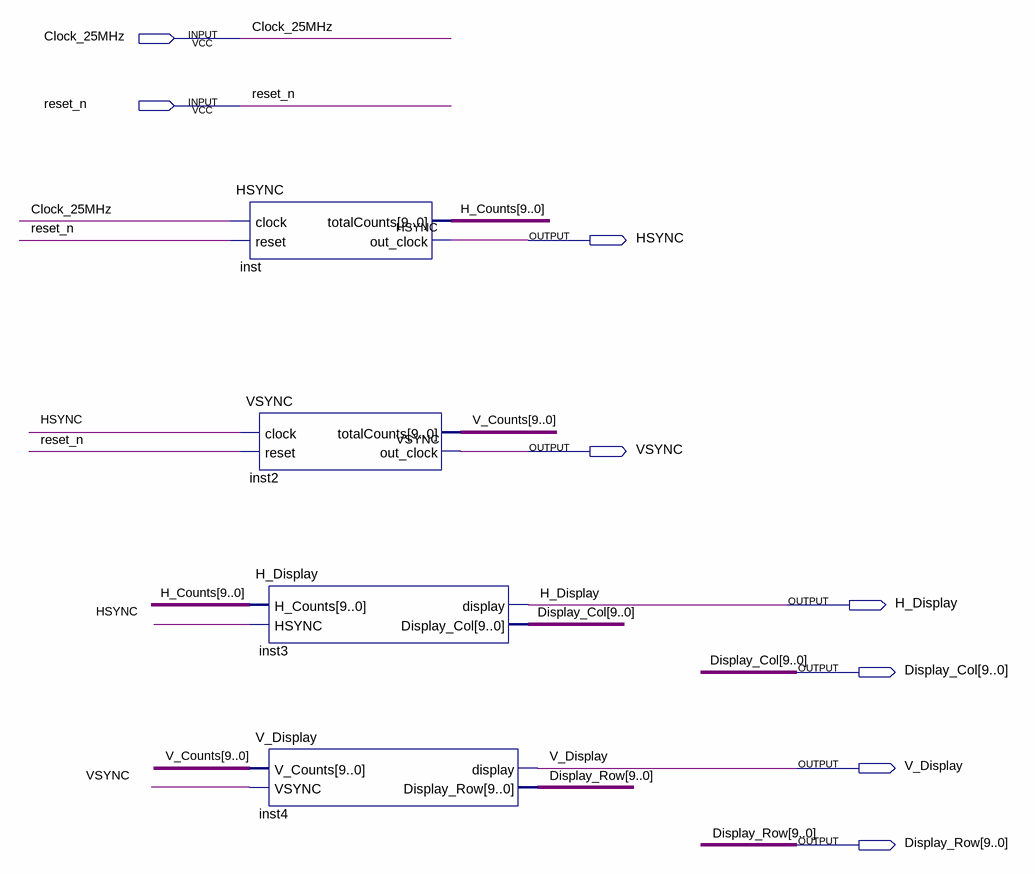
[diagram p0: schematic sheet]
// Quartus schematic VGA_SYNC_Module.bdf as structural Verilog: 4 symbols, 8 pins
module VGA_SYNC_Module (
  input  Clock_25MHz,
  input  reset_n,
  output HSYNC,
  output VSYNC,
  output H_Display,
  output [9:0] Display_Col,
  output V_Display,
  output [9:0] Display_Row
);

  wire [9:0] H_Counts, V_Counts;

  HSYNC inst (.clock(Clock_25MHz), .reset(reset_n), .totalCounts(H_Counts), .out_clock(HSYNC));
  VSYNC inst2 (.clock(HSYNC), .reset(reset_n), .totalCounts(V_Counts), .out_clock(VSYNC));
  H_Display inst3 (.H_Counts(H_Counts), .HSYNC(HSYNC), .display(H_Display), .Display_Col(Display_Col));
  V_Display inst4 (.V_Counts(V_Counts), .VSYNC(VSYNC), .display(V_Display), .Display_Row(Display_Row));
endmodule
